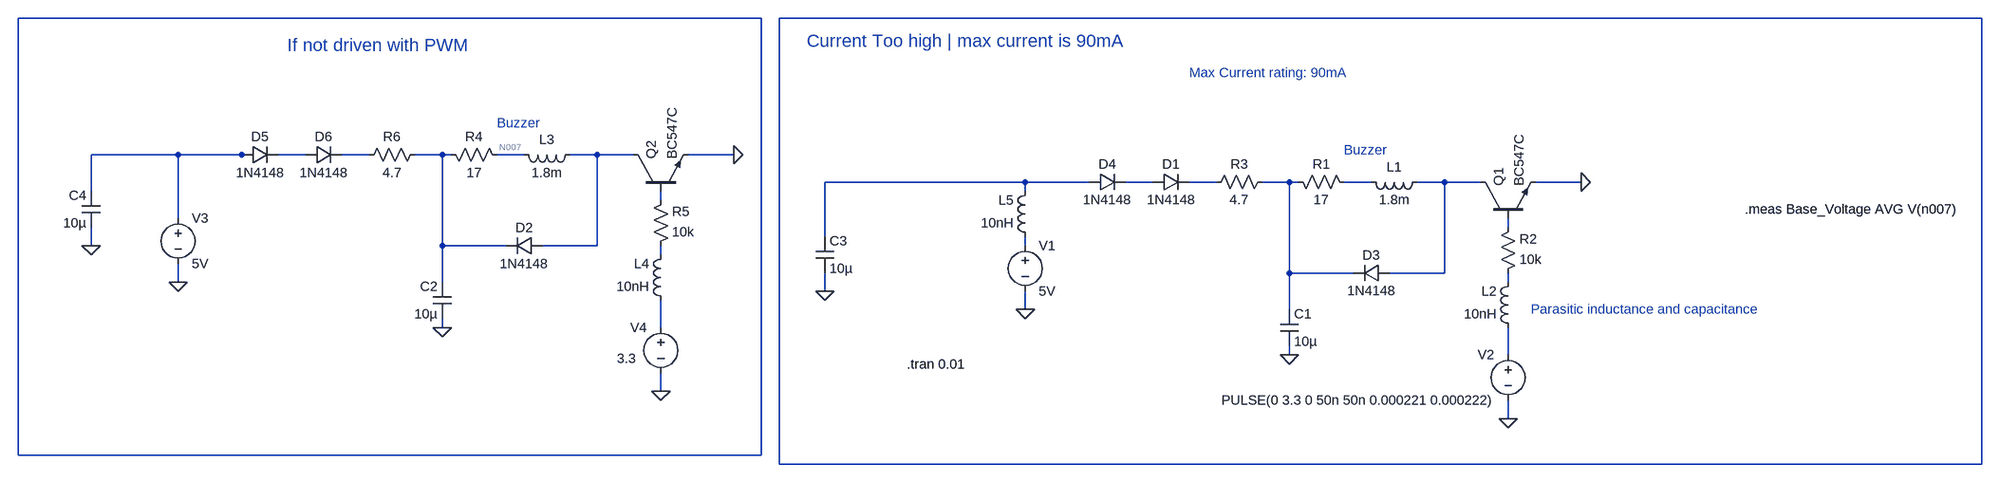
[diagram p0: schematic Buzzer simulation.asc]
Buzzer simulation.asc, the LTspice schematic file:
Version 4.1
SHEET 1 2784 680
WIRE -176 -464 -1504 -464
WIRE 1968 -464 -144 -464
WIRE -1200 -224 -1376 -224
WIRE -1088 -224 -1200 -224
WIRE -1072 -224 -1088 -224
WIRE -976 -224 -1024 -224
WIRE -864 -224 -912 -224
WIRE -736 -224 -784 -224
WIRE -720 -224 -736 -224
WIRE -592 -224 -640 -224
WIRE -464 -224 -512 -224
WIRE -400 -224 -464 -224
WIRE -224 -224 -304 -224
WIRE 288 -176 -64 -176
WIRE 400 -176 288 -176
WIRE 512 -176 464 -176
WIRE 624 -176 576 -176
WIRE 752 -176 704 -176
WIRE 768 -176 752 -176
WIRE 896 -176 848 -176
WIRE 1024 -176 976 -176
WIRE 1088 -176 1024 -176
WIRE 1264 -176 1184 -176
WIRE -1376 -160 -1376 -224
WIRE 288 -160 288 -176
WIRE -352 -144 -352 -160
WIRE -1200 -112 -1200 -224
WIRE 1136 -96 1136 -112
WIRE -64 -80 -64 -176
WIRE -1376 -64 -1376 -96
WIRE -736 -64 -736 -224
WIRE -624 -64 -736 -64
WIRE -464 -64 -464 -224
WIRE -464 -64 -560 -64
WIRE 288 -64 288 -80
WIRE -352 -48 -352 -64
WIRE 752 -16 752 -176
WIRE 864 -16 752 -16
WIRE 1024 -16 1024 -176
WIRE 1024 -16 928 -16
WIRE -1200 0 -1200 -32
WIRE -736 0 -736 -64
WIRE 1136 0 1136 -16
WIRE -64 16 -64 -16
WIRE 288 48 288 16
WIRE 752 48 752 -16
WIRE -736 80 -736 64
WIRE -352 80 -352 32
WIRE 752 128 752 112
WIRE 1136 128 1136 80
WIRE -352 192 -352 160
WIRE 1136 240 1136 208
WIRE -1504 304 -1504 -464
WIRE -176 304 -176 -464
WIRE -176 304 -1504 304
WIRE -144 320 -144 -464
WIRE 1968 320 1968 -464
WIRE 1968 320 -144 320
FLAG 752 128 0
FLAG 1264 -176 0
FLAG 1136 240 0
FLAG 288 48 0
FLAG -64 16 0
FLAG -736 80 0
FLAG -224 -224 0
FLAG -352 192 0
FLAG -1200 0 0
FLAG -1376 -64 0
SYMBOL res 752 -192 M90
WINDOW 0 0 56 VBottom 2
WINDOW 3 32 56 VTop 2
SYMATTR InstName R1
SYMATTR Value 17
SYMATTR SpiceLine tol=17 pwr=26
SYMBOL ind 880 -192 M90
WINDOW 0 5 56 VBottom 2
WINDOW 3 32 56 VTop 2
SYMATTR InstName L1
SYMATTR Value 1.8m
SYMATTR SpiceLine Ipk=0.95 Rser=1.63 Rpar=139043 Cpar=0 mfg="Coilcraft" pn="MSS1210-185"
SYMBOL voltage 288 -80 R0
WINDOW 123 0 0 Left 0
WINDOW 39 0 0 Left 0
SYMATTR InstName V1
SYMATTR Value 5V
SYMBOL diode 928 0 M270
WINDOW 0 32 32 VTop 2
WINDOW 3 0 32 VBottom 2
SYMATTR InstName D3
SYMATTR Value 1N4148
SYMBOL cap 736 112 M180
WINDOW 0 24 56 Left 2
WINDOW 3 24 8 Left 2
SYMATTR InstName C1
SYMATTR Value 10µ
SYMATTR SpiceLine V=16 Irms=0 Rser=0 Lser=0 mfg="Murata" pn="GRM21BZ71C106ME15" type="X7R"
SYMBOL npn 1088 -112 R270
SYMATTR InstName Q1
SYMATTR Value BC547C
SYMBOL res 1120 0 M180
WINDOW 0 36 76 Left 2
WINDOW 3 36 40 Left 2
SYMATTR InstName R2
SYMATTR Value 10k
SYMBOL voltage 1136 112 M0
WINDOW 123 0 0 Left 0
WINDOW 39 0 0 Left 0
SYMATTR InstName V2
SYMATTR Value PULSE(0 3.3 0 50n 50n 0.000221 0.000222)
SYMBOL diode 400 -192 M90
WINDOW 0 0 32 VBottom 2
WINDOW 3 32 32 VTop 2
SYMATTR InstName D4
SYMATTR Value 1N4148
SYMBOL diode 512 -192 M90
WINDOW 0 0 32 VBottom 2
WINDOW 3 32 32 VTop 2
SYMATTR InstName D1
SYMATTR Value 1N4148
SYMBOL res 608 -160 R270
WINDOW 0 32 56 VTop 2
WINDOW 3 0 56 VBottom 2
SYMATTR InstName R3
SYMATTR Value 4.7
SYMATTR SpiceLine tol=1
SYMBOL ind 1152 96 R180
WINDOW 0 36 80 Left 2
WINDOW 3 36 40 Left 2
SYMATTR InstName L2
SYMATTR Value 10nH
SYMATTR SpiceLine Ipk=1 Rser=1m Cpar=10pF
SYMBOL cap -80 -16 M180
WINDOW 0 24 56 Left 2
WINDOW 3 24 8 Left 2
SYMATTR InstName C3
SYMATTR Value 10µ
SYMATTR SpiceLine V=16 Irms=0 Rser=0 Lser=0 mfg="Murata" pn="GRM21BZ71C106ME15" type="X7R"
SYMBOL res -736 -240 M90
WINDOW 0 0 56 VBottom 2
WINDOW 3 32 56 VTop 2
SYMATTR InstName R4
SYMATTR Value 17
SYMATTR SpiceLine tol=17 pwr=26
SYMBOL ind -608 -240 M90
WINDOW 0 5 56 VBottom 2
WINDOW 3 32 56 VTop 2
SYMATTR InstName L3
SYMATTR Value 1.8m
SYMATTR SpiceLine Ipk=0.95 Rser=1.63 Rpar=139043 Cpar=0 mfg="Coilcraft" pn="MSS1210-185"
SYMBOL voltage -1200 -128 R0
WINDOW 123 0 0 Left 0
WINDOW 39 0 0 Left 0
SYMATTR InstName V3
SYMATTR Value 5V
SYMBOL diode -560 -48 M270
WINDOW 0 32 32 VTop 2
WINDOW 3 0 32 VBottom 2
SYMATTR InstName D2
SYMATTR Value 1N4148
SYMBOL cap -720 0 M0
SYMATTR InstName C2
SYMATTR Value 10µ
SYMATTR SpiceLine V=16 Irms=0 Rser=0 Lser=0 mfg="Murata" pn="GRM21BZ71C106ME15" type="X7R"
SYMBOL npn -400 -160 R270
SYMATTR InstName Q2
SYMATTR Value BC547C
SYMBOL res -368 -48 M180
WINDOW 0 36 76 Left 2
WINDOW 3 36 40 Left 2
SYMATTR InstName R5
SYMATTR Value 10k
SYMBOL voltage -352 64 M0
WINDOW 3 43 70 Left 2
WINDOW 123 0 0 Left 0
WINDOW 39 0 0 Left 0
SYMATTR InstName V4
SYMATTR Value 3.3
SYMBOL diode -1088 -240 M90
WINDOW 0 0 32 VBottom 2
WINDOW 3 32 32 VTop 2
SYMATTR InstName D5
SYMATTR Value 1N4148
SYMBOL diode -976 -240 M90
WINDOW 0 0 32 VBottom 2
WINDOW 3 32 32 VTop 2
SYMATTR InstName D6
SYMATTR Value 1N4148
SYMBOL res -768 -240 R90
WINDOW 0 0 56 VBottom 2
WINDOW 3 32 56 VTop 2
SYMATTR InstName R6
SYMATTR Value 4.7
SYMATTR SpiceLine tol=1
SYMBOL ind -336 48 R180
WINDOW 0 36 80 Left 2
WINDOW 3 36 40 Left 2
SYMATTR InstName L4
SYMATTR Value 10nH
SYMATTR SpiceLine Ipk=1 Rser=1m Cpar=10pF
SYMBOL cap -1360 -160 M0
SYMATTR InstName C4
SYMATTR Value 10µ
SYMATTR SpiceLine V=16 Irms=0 Rser=0 Lser=0 mfg="Murata" pn="GRM21BZ71C106ME15" type="X7R"
SYMBOL ind 304 -64 R180
WINDOW 0 36 80 Left 2
WINDOW 3 36 40 Left 2
SYMATTR InstName L5
SYMATTR Value 10nH
SYMATTR SpiceLine Ipk=1 Rser=1m Cpar=10pF
TEXT 576 -368 Left 2 ;Max Current rating: 90mA
TEXT 848 -232 Left 2 ;Buzzer
TEXT 80 144 Left 2 !.tran 0.01
TEXT 1552 -128 Left 2 !.meas Base_Voltage AVG V(n007)
TEXT 1176 48 Left 2 ;Parasitic inductance and capacitance
TEXT -640 -280 Left 2 ;Buzzer
TEXT -1008 -416 Left 3 ;If not driven with PWM
TEXT -96 -424 Left 3 ;Current Too high | max current is 90mA

The netlist it stands for:
* Buzzer simulation.asc
R1 N012 N013 17 tol=17 pwr=26
L1 N013 N014 1.8m Ipk=0.95 Rser=1.63 Rpar=139043 Cpar=0 mfg="Coilcraft" pn="MSS1210-185"
V1 N017 0 5V
D3 N014 N012 1N4148
C1 0 N012 10µ V=16 Irms=0 Rser=0 Lser=0 mfg="Murata" pn="GRM21BZ71C106ME15" type="X7R"
Q1 N014 N016 0 0 BC547C
R2 N019 N016 10k
V2 N021 0 PULSE(0 3.3 0 50n 50n 0.000221 0.000222)
D4 N009 N010 1N4148
D1 N010 N011 1N4148
R3 N011 N012 4.7 tol=1
L2 N021 N019 10nH Ipk=1 Rser=1m Cpar=10pF
C3 0 N009 10µ V=16 Irms=0 Rser=0 Lser=0 mfg="Murata" pn="GRM21BZ71C106ME15" type="X7R"
R4 N006 N007 17 tol=17 pwr=26
L3 N007 N008 1.8m Ipk=0.95 Rser=1.63 Rpar=139043 Cpar=0 mfg="Coilcraft" pn="MSS1210-185"
V3 N003 0 5V
D2 N008 N006 1N4148
C2 N006 0 10µ V=16 Irms=0 Rser=0 Lser=0 mfg="Murata" pn="GRM21BZ71C106ME15" type="X7R"
Q2 N008 N015 0 0 BC547C
R5 N018 N015 10k
V4 N020 0 3.3
D5 N003 N004 1N4148
D6 N004 N005 1N4148
R6 N006 N005 4.7 tol=1
L4 N020 N018 10nH Ipk=1 Rser=1m Cpar=10pF
C4 N003 0 10µ V=16 Irms=0 Rser=0 Lser=0 mfg="Murata" pn="GRM21BZ71C106ME15" type="X7R"
L5 N017 N009 10nH Ipk=1 Rser=1m Cpar=10pF
.model D D
.lib standard.dio
.model NPN NPN
.model PNP PNP
.lib standard.bjt
* Max Current rating: 90mA
* Buzzer
.tran 0.01
.meas Base_Voltage AVG V(n007)
* Parasitic inductance and capacitance
* Buzzer
* If not driven with PWM
* Current Too high | max current is 90mA
.backanno
.end